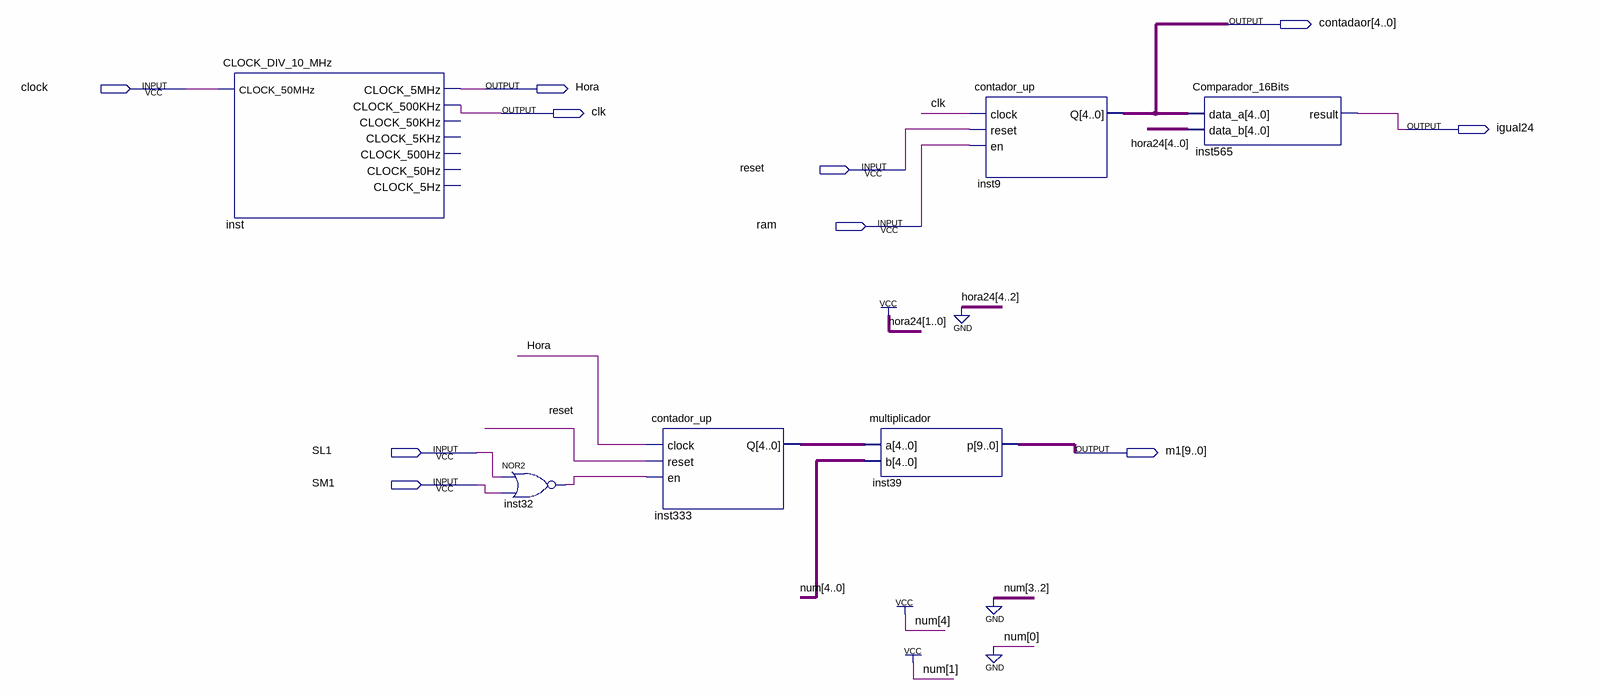
[diagram p0: schematic sheet]
// Quartus schematic Block2.bdf as structural Verilog: 6 symbols, 10 pins
module Block2 (
  input  clock,
  input  reset,
  input  ram,
  input  SL1,
  input  SM1,
  output [4:0] contadaor,
  output Hora,
  output clk,
  output igual24,
  output [9:0] m1
);

  wire inst32_out;
  wire [4:0] inst333_q;

  CLOCK_DIV_10_MHz inst (
    .CLOCK_50MHz(clock), .CLOCK_5MHz(Hora), .CLOCK_500KHz(clk));  // open: CLOCK_50KHz, CLOCK_5KHz, CLOCK_500Hz, CLOCK_50Hz, CLOCK_5Hz
  nor inst32 (inst32_out, SL1, SM1);
  contador_up inst333 (.clock(Hora), .reset(reset), .en(inst32_out), .Q(inst333_q));
  multiplicador inst39 (.a(inst333_q), .b(5'b10010), .p(m1));
  contador_up inst9 (.clock(clk), .reset(reset), .en(ram), .Q(contadaor));
  Comparador_16Bits inst565 (.data_a(contadaor), .data_b(5'b00011), .result(igual24));
endmodule
